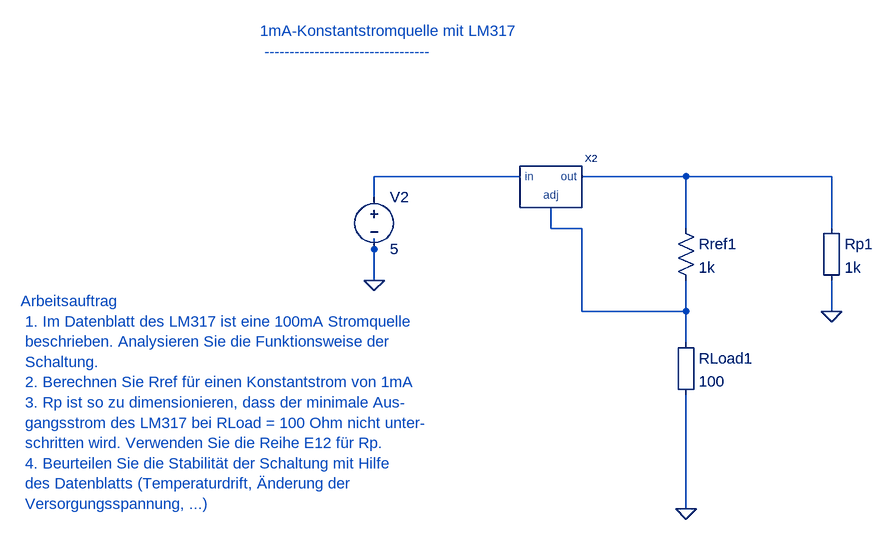
[diagram p0: schematic 1_5_3_Konstantstromquelle_mit_LM317.asc]
1_5_3_Konstantstromquelle_mit_LM317.asc, the LTspice schematic file:
Version 4
SHEET 1 880 680
WIRE 928 368 928 400
WIRE 928 400 976 400
WIRE 976 320 1072 320
WIRE 656 432 656 416
WIRE 656 352 656 320
WIRE 656 320 880 320
WIRE 656 480 656 416
WIRE 1072 320 1136 320
WIRE 1360 480 1360 528
WIRE 976 400 976 528
WIRE 976 528 1136 528
WIRE 1136 656 1136 832
WIRE 1136 528 1136 576
WIRE 1136 480 1136 528
WIRE 1136 320 1360 320
WIRE 1360 320 1360 400
WIRE 1136 400 1136 320
FLAG 656 480 0
FLAG 1136 832 0
FLAG 1360 528 0
FLAG 656 480 0
FLAG 1136 832 0
FLAG 1360 528 0
SYMBOL Ureg 928 336 R0
SYMATTR InstName X2
SYMATTR Prefix X
SYMATTR SpiceModel LM317/TI
SYMBOL voltage 656 336 R0
SYMATTR InstName V2
SYMATTR Value 5
SYMBOL Misc\EuropeanResistor 1120 560 R0
SYMATTR InstName RLoad1
SYMATTR Value 100
SYMBOL res 1120 384 R0
SYMATTR InstName Rref1
SYMATTR Value 1k
SYMBOL Misc\EuropeanResistor 1344 384 R0
SYMATTR InstName Rp1
SYMATTR Value 1k
TEXT 480 96 Left 2 ;1mA-Konstantstromquelle mit LM317 \n ---------------------------------
TEXT 112 512 Left 2 ;Arbeitsauftrag \n 1. Im Datenblatt des LM317 ist eine 100mA Stromquelle \n beschrieben. Analysieren Sie die Funktionsweise der \n Schaltung. \n 2. Berechnen Sie Rref für einen Konstantstrom von 1mA \n 3. Rp ist so zu dimensionieren, dass der minimale Aus- \n gangsstrom des LM317 bei RLoad = 100 Ohm nicht unter- \n schritten wird. Verwenden Sie die Reihe E12 für Rp. \n 4. Beurteilen Sie die Stabilität der Schaltung mit Hilfe \n des Datenblatts (Temperaturdrift, Änderung der \n Versorgungsspannung, ...)

The netlist it stands for:
* 1_5_3_Konstantstromquelle_mit_LM317.asc
XX2 N003 N001 N002 Ureg  ; pins in adj out
V2 N003 0 5
RLoad1 N001 0 100
Rref1 N002 N001 1k
Rp1 N002 0 1k
* 1mA-Konstantstromquelle mit LM317
*  ---------------------------------
* Arbeitsauftrag
*  1. Im Datenblatt des LM317 ist eine 100mA Stromquelle
*  beschrieben. Analysieren Sie die Funktionsweise der
*  Schaltung.
*  2. Berechnen Sie Rref für einen Konstantstrom von 1mA
*  3. Rp ist so zu dimensionieren, dass der minimale Aus-
*  gangsstrom des LM317 bei RLoad = 100 Ohm nicht unter-
*  schritten wird. Verwenden Sie die Reihe E12 für Rp.
*  4. Beurteilen Sie die Stabilität der Schaltung mit Hilfe
*  des Datenblatts (Temperaturdrift, Änderung der
*  Versorgungsspannung, ...)
.backanno
.end